# Altium schematic sheet GSM Modem Power Feed.SchDoc: GSM Modem Power Feed
size 292 x 193 mm; SheetNumber: 3; SheetTotal: 14
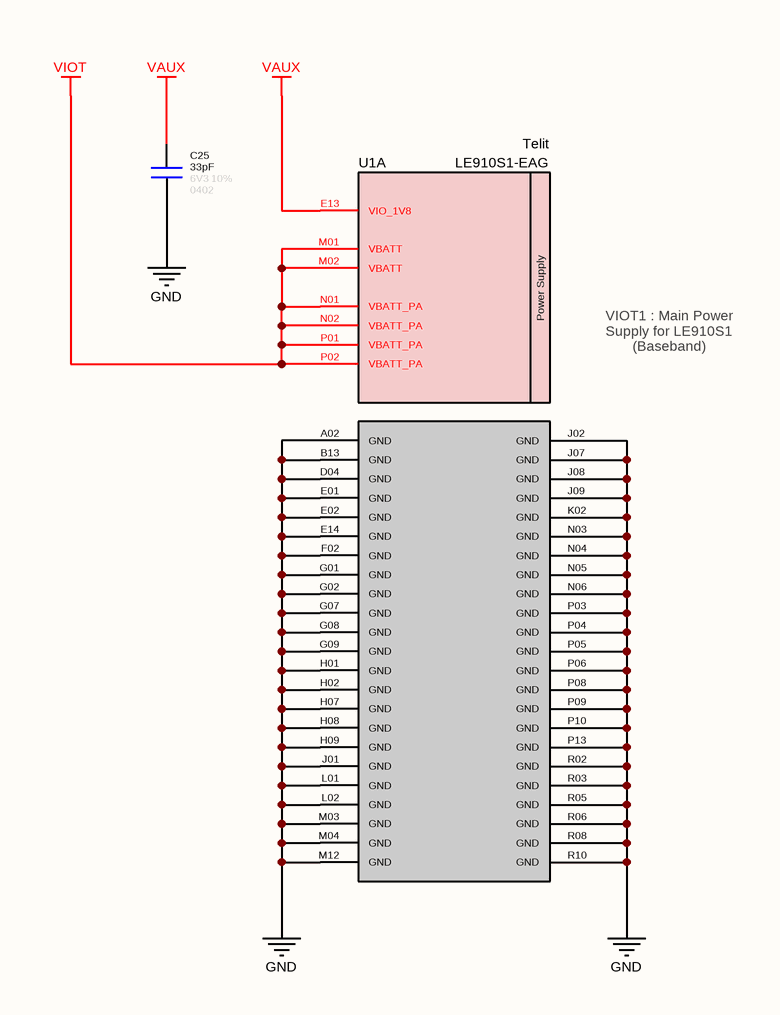
[diagram p0: GSM Modem Power Feed.SchDoc]

## Parts
C25  value 33pF  Tolerance: 10%  Case: 0402  Voltage: 6V3  [CAPACITOR_0402]  (hidden comment: Capacitor - 33pF [0402] (Ceramic))
U1  Manufacturer Part Number: LE910S1-EAG  Manufacturer Name: Telit  [LE910 GSM Modem]  (hidden comment: LE910S1-EAG LTE GSM Module)  (part A of 19)

## Nets
GND: C25.1 U1.A02(GND) U1.B13(GND) U1.D04(GND) U1.E01(GND) U1.E02(GND) U1.E14(GND) U1.F02(GND) U1.G01(GND) U1.G02(GND) U1.G07(GND) U1.G08(GND) U1.G09(GND) U1.H01(GND) U1.H02(GND) U1.H07(GND) U1.H08(GND) U1.H09(GND) U1.J01(GND) U1.J02(GND) U1.J07(GND) U1.J08(GND) U1.J09(GND) U1.K02(GND) U1.L01(GND) U1.L02(GND) U1.M03(GND) U1.M04(GND) U1.M12(GND) U1.N03(GND) U1.N04(GND) U1.N05(GND) U1.N06(GND) U1.P03(GND) U1.P04(GND) U1.P05(GND) U1.P06(GND) U1.P08(GND) U1.P09(GND) U1.P10(GND) U1.P13(GND) U1.R02(GND) U1.R03(GND) U1.R05(GND) U1.R06(GND) U1.R08(GND) U1.R10(GND)
VAUX: C25.2 U1.E13(VIO_1V8)
VIOT: U1.M01(VBATT) U1.M02(VBATT) U1.N01(VBATT_PA) U1.N02(VBATT_PA) U1.P01(VBATT_PA) U1.P02(VBATT_PA)

## Notes on the sheet
- (near U1) VIOT1 : Main Power Supply for LE910S1 (Baseband)
- © 2021 All rights reserved.
  This document may not, in whole or in part, be copied, photocopied, reproduced, translated or converted to any electronic or machine readable from without prior written permission of Mehmet Günce Akkoyun.
  Engineer contact : akkoyun@me.com
- Property of
- Engineer :
- Date :
- Size :
- A4
- Time :
- Project :
- Page :
- /
- Customer :
- Product ID :
- Module ID :
- Version :
- File :
- Revision :
- (in symbol IC - LE910S1-EAG, part A) Power Supply

## Library data of the parts
C25 = Capacitor - 33pF [0402-6V3]: Manufacturer Name: Kemet; Manufacturer Part Number: C0402C330J9RACAUTO; ComponentLink1Description: DataSheet; ComponentLink1URL: https://api.kemet.com/component-edge/download/datasheet/C0402C330J9RACAUTO.pdf; ComponentLink2Description: Mouser; ComponentLink2URL: https://www.mouser.com/Search/Refine.aspx?Keyword=80-C0402C330J9RAUTO
U1 = IC - LE910S1-EAG: Telit LE910S1-EAG GPRS/GNSS Module; Case: BGA